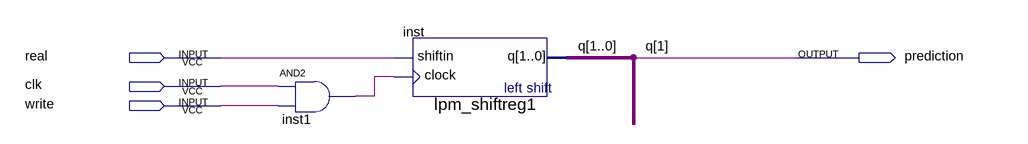
[diagram p0: schematic sheet]
// Quartus schematic A2.bdf as structural Verilog: 2 symbols, 4 pins
module A2 (
  input  \real ,
  input  clk,
  input  write,
  output prediction
);

  wire inst1_out;
  wire [0:0] q;

  and inst1 (inst1_out, clk, write);
  lpm_shiftreg1 inst (.clock(inst1_out), .shiftin(\real ), .q({prediction, q[0]}));

  // Other names for the same wires on the sheet: q[1] = prediction
endmodule
